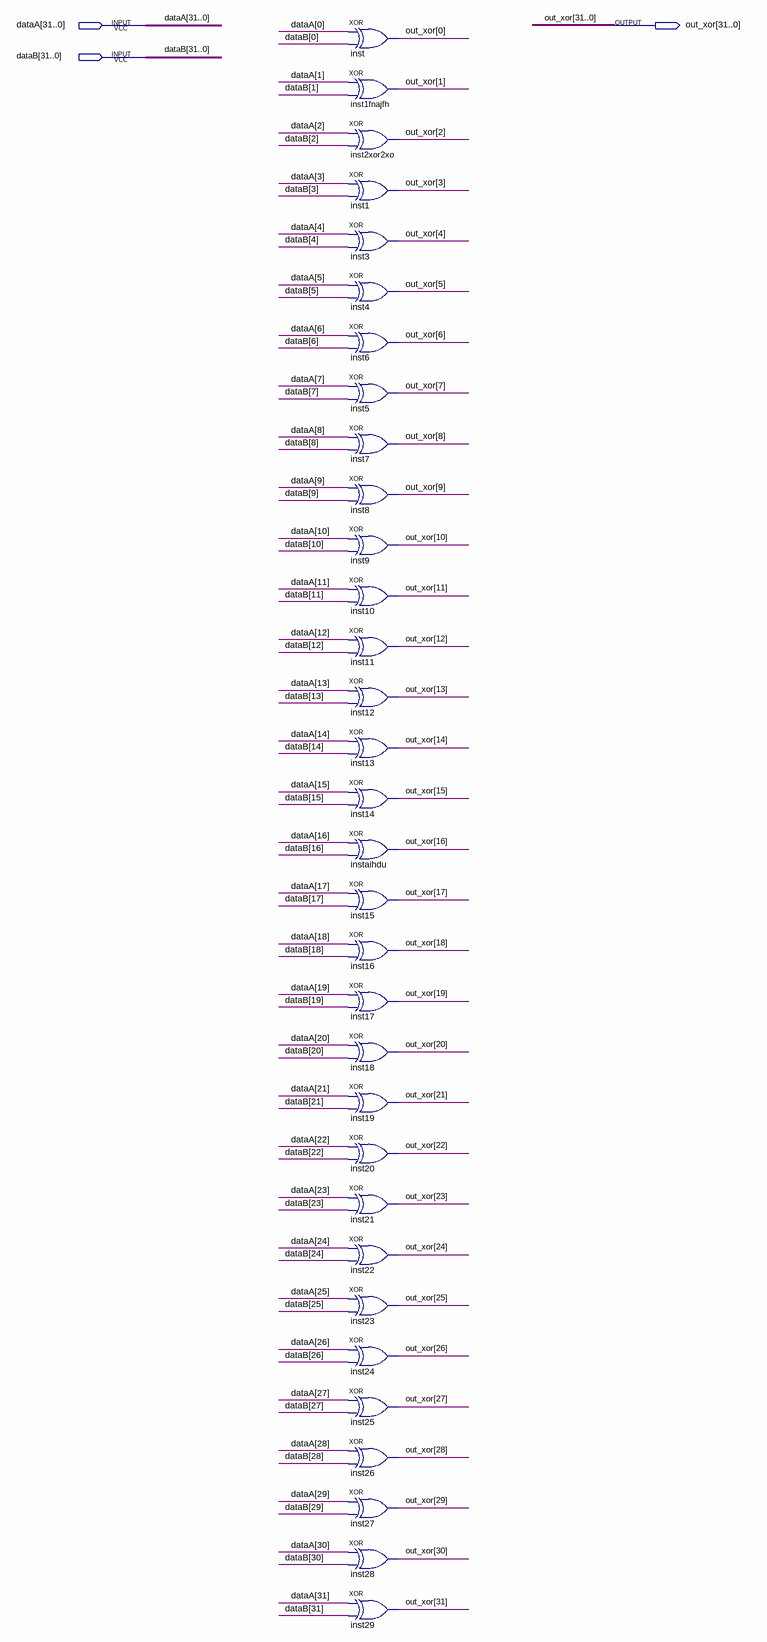
[diagram p0: schematic sheet]
// Quartus schematic xor_instruction.bdf as structural Verilog: 32 symbols, 3 pins
module xor_instruction (
  input  [31:0] dataA,
  input  [31:0] dataB,
  output [31:0] out_xor
);

  xor inst (out_xor[0], dataA[0], dataB[0]);
  xor inst1fnajfh (out_xor[1], dataA[1], dataB[1]);
  xor inst2xor2xo (out_xor[2], dataA[2], dataB[2]);
  xor inst1 (out_xor[3], dataA[3], dataB[3]);
  xor inst3 (out_xor[4], dataA[4], dataB[4]);
  xor inst4 (out_xor[5], dataA[5], dataB[5]);
  xor inst6 (out_xor[6], dataA[6], dataB[6]);
  xor inst5 (out_xor[7], dataA[7], dataB[7]);
  xor inst7 (out_xor[8], dataA[8], dataB[8]);
  xor inst8 (out_xor[9], dataA[9], dataB[9]);
  xor inst9 (out_xor[10], dataA[10], dataB[10]);
  xor inst10 (out_xor[11], dataA[11], dataB[11]);
  xor inst11 (out_xor[12], dataA[12], dataB[12]);
  xor inst12 (out_xor[13], dataA[13], dataB[13]);
  xor inst13 (out_xor[14], dataA[14], dataB[14]);
  xor inst14 (out_xor[15], dataA[15], dataB[15]);
  xor instaihdu (out_xor[16], dataA[16], dataB[16]);
  xor inst15 (out_xor[17], dataA[17], dataB[17]);
  xor inst16 (out_xor[18], dataA[18], dataB[18]);
  xor inst17 (out_xor[19], dataA[19], dataB[19]);
  xor inst18 (out_xor[20], dataA[20], dataB[20]);
  xor inst19 (out_xor[21], dataA[21], dataB[21]);
  xor inst20 (out_xor[22], dataA[22], dataB[22]);
  xor inst21 (out_xor[23], dataA[23], dataB[23]);
  xor inst22 (out_xor[24], dataA[24], dataB[24]);
  xor inst23 (out_xor[25], dataA[25], dataB[25]);
  xor inst24 (out_xor[26], dataA[26], dataB[26]);
  xor inst25 (out_xor[27], dataA[27], dataB[27]);
  xor inst26 (out_xor[28], dataA[28], dataB[28]);
  xor inst27 (out_xor[29], dataA[29], dataB[29]);
  xor inst28 (out_xor[30], dataA[30], dataB[30]);
  xor inst29 (out_xor[31], dataA[31], dataB[31]);
endmodule
